# EAGLE design ScienceOnStick_V7-April2022 (EAGLE 9.5.2)
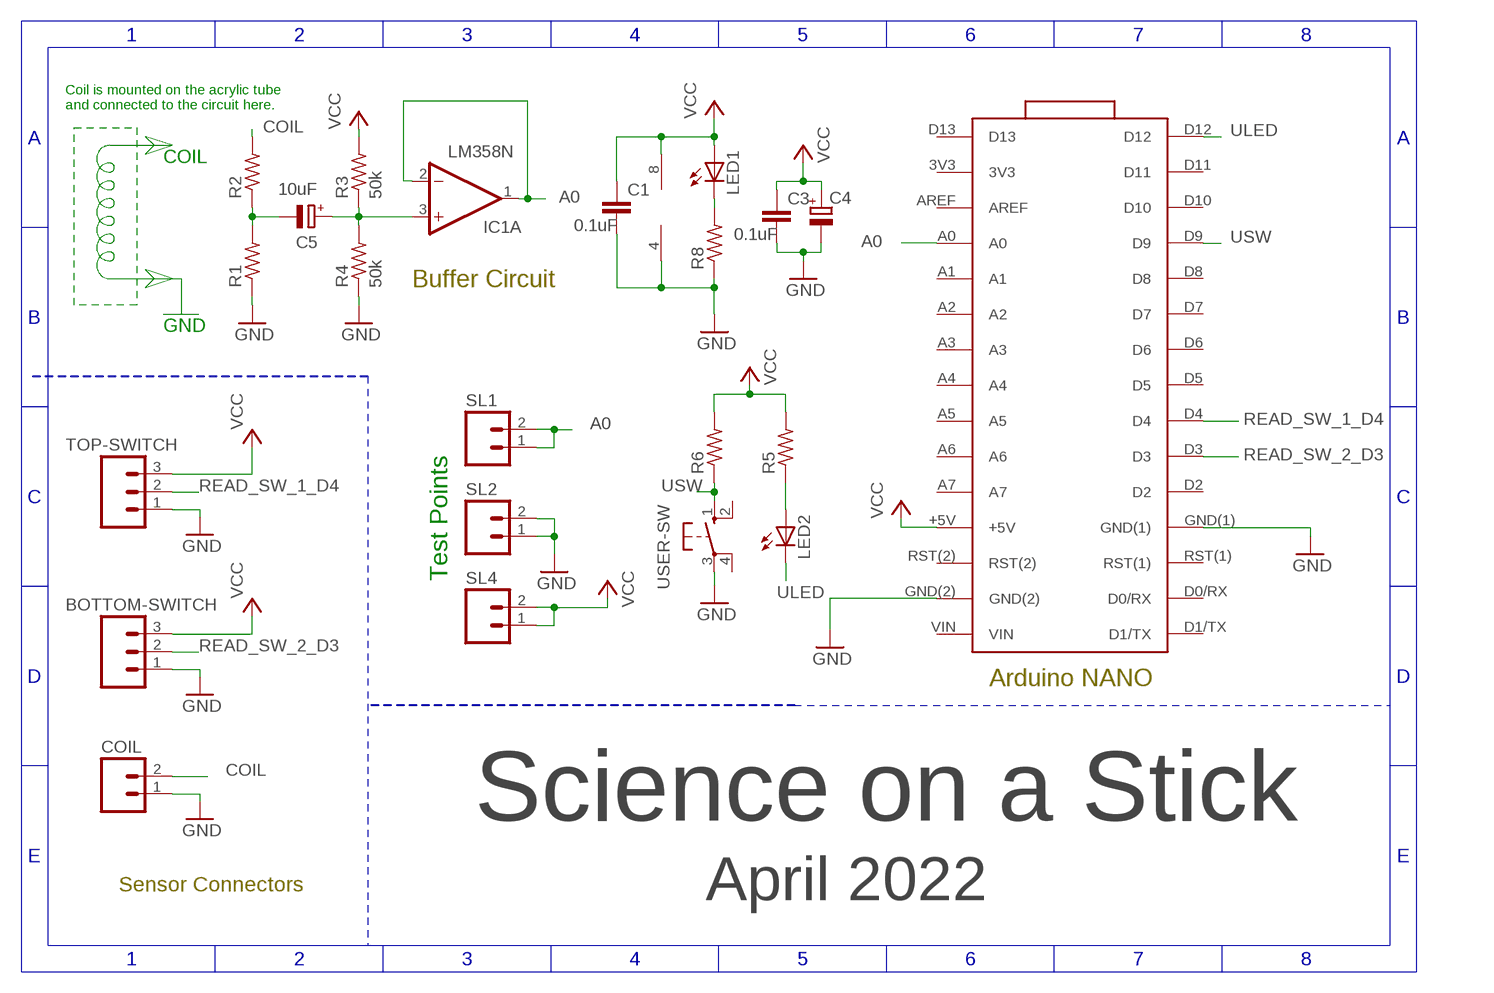
[diagram p0: schematic, sheet 1]

## Parts
BOTTOM-SWITCH  M03  [03P]
C1  0.1uF  C-EU025-025X050  [C025-025X050]
C3  0.1uF  C-EU025-025X050  [C025-025X050]
C4  CPOL-EUE2.5-6  [E2,5-6]
C5  10uF  CPOL-EUE2.5-6  [E2,5-6]
COIL  M02  [02P]
IC1  LM358N  [DIL08]
LED1  LED3MM  [LED3MM]
LED2  LED3MM  [LED3MM]
R1  RESISTOR0207/7  [0207/7]
R2  RESISTOR0207/7  [0207/7]
R3  50k  RESISTOR0207/7  [0207/7]
R4  50k  RESISTOR0207/7  [0207/7]
R5  RESISTOR0207/7  [0207/7]
R6  RESISTOR0207/7  [0207/7]
R8  RESISTOR0207/7  [0207/7]
SL1  M02  [02P]
SL2  M02  [02P]
SL4  M02  [02P]
TOP-SWITCH  M03  [03P]
U$1  ARDUINO_NANO_3_ARDUINO(NANO_3.0)  [ARDUINO_NANO_3_ARDUINO_NANO_30PIN]
USER-SW  40-XX  [B3F-40XX]

## Nets
A0: IC1.1(A:OUT) IC1.2(A:-IN) SL1.1 SL1.2 U$1.A0
CLAMP_SIGNAL: C5.+ IC1.3(A:+IN) R3.1 R4.2
COIL: COIL.2 R2.2
GND: BOTTOM-SWITCH.1 C1.2 C3.2 C4.- COIL.1 IC1.4(P:V-) R1.1 R4.1 R8.1 SL2.1 SL2.2 TOP-SWITCH.1 U$1.GND(1) U$1.GND(2) USER-SW.3(P)
N$1: C5.- R1.2 R2.1
N$2: LED2.A R5.1
N$5: LED1.K(C) R8.2
READ_SW_1_D4: TOP-SWITCH.2 U$1.D4
READ_SW_2_D3: BOTTOM-SWITCH.2 U$1.D3
ULED: LED2.K(C) U$1.D12
USW: R6.1 U$1.D9 USER-SW.1(S)
VCC: BOTTOM-SWITCH.3 C1.1 C3.1 C4.+ IC1.8(P:V+) LED1.A R3.2 R5.2 R6.2 SL4.1 SL4.2 TOP-SWITCH.3 U$1.+5V
Unconnected: IC1.5(B:+IN) IC1.6(B:-IN) IC1.7(B:OUT) U$1.3V3 U$1.A1 U$1.A2 U$1.A3 U$1.A4 U$1.A5 U$1.A6 U$1.A7 U$1.AREF U$1.D0/RX U$1.D1/TX U$1.D2 U$1.D5 U$1.D6 U$1.D7 U$1.D8 U$1.D10 U$1.D11 U$1.D13 U$1.RST(1) U$1.RST(2) U$1.VIN USER-SW.2(S1) USER-SW.4(P1)

## Buses
B$1

## Notes on the sheet
- Coil is mounted on the acrylic tube 
  and connected to the circuit here.
- COIL
- Buffer Circuit
- GND
- Test Points
- Arduino NANO
- Science on a Stick
- Sensor Connectors
- April 2022

## Library data of the parts
BOTTOM-SWITCH TOP-SWITCH = con-amp-quick:M03: AMP QUICK CONNECTOR; OC_FARNELL: unknown; OC_NEWARK: unknown
C1 C3 = Arduino_Hackathon_v5:C-EU: CAPACITOR, European symbol
C4 C5 = rcl:CPOL-EU: POLARIZED CAPACITOR, European symbol; SPICEPREFIX: C
COIL SL1 SL2 SL4 = con-amp-quick:M02: AMP QUICK CONNECTOR; OC_FARNELL: unknown; OC_NEWARK: unknown
IC1 = CEDT_JANUARY_2015_v5:LM358: OP AMP also LM158; LM258; LM2904 Source: http://cache.national.com/ds/LM/LM158.pdf
LED1 LED2 = CEDT_JANUARY_2015_v5:LED
R1-R4 = Arduino_Hackathon_v5:RESISTOR
R5 R6 R8 = CEDT_JANUARY_2015_v5:RESISTOR
U$1 = 1 D hour glass_V1:ARDUINO_NANO_3_ARDUINO(NANO_3.0)
USER-SW = switch-omron:40-XX: OMRON SWITCH; MF: OMRON COMPONENTS USA; MPN: B3F-4000; OC_FARNELL: 176434; OC_NEWARK: 36K3105

## Board
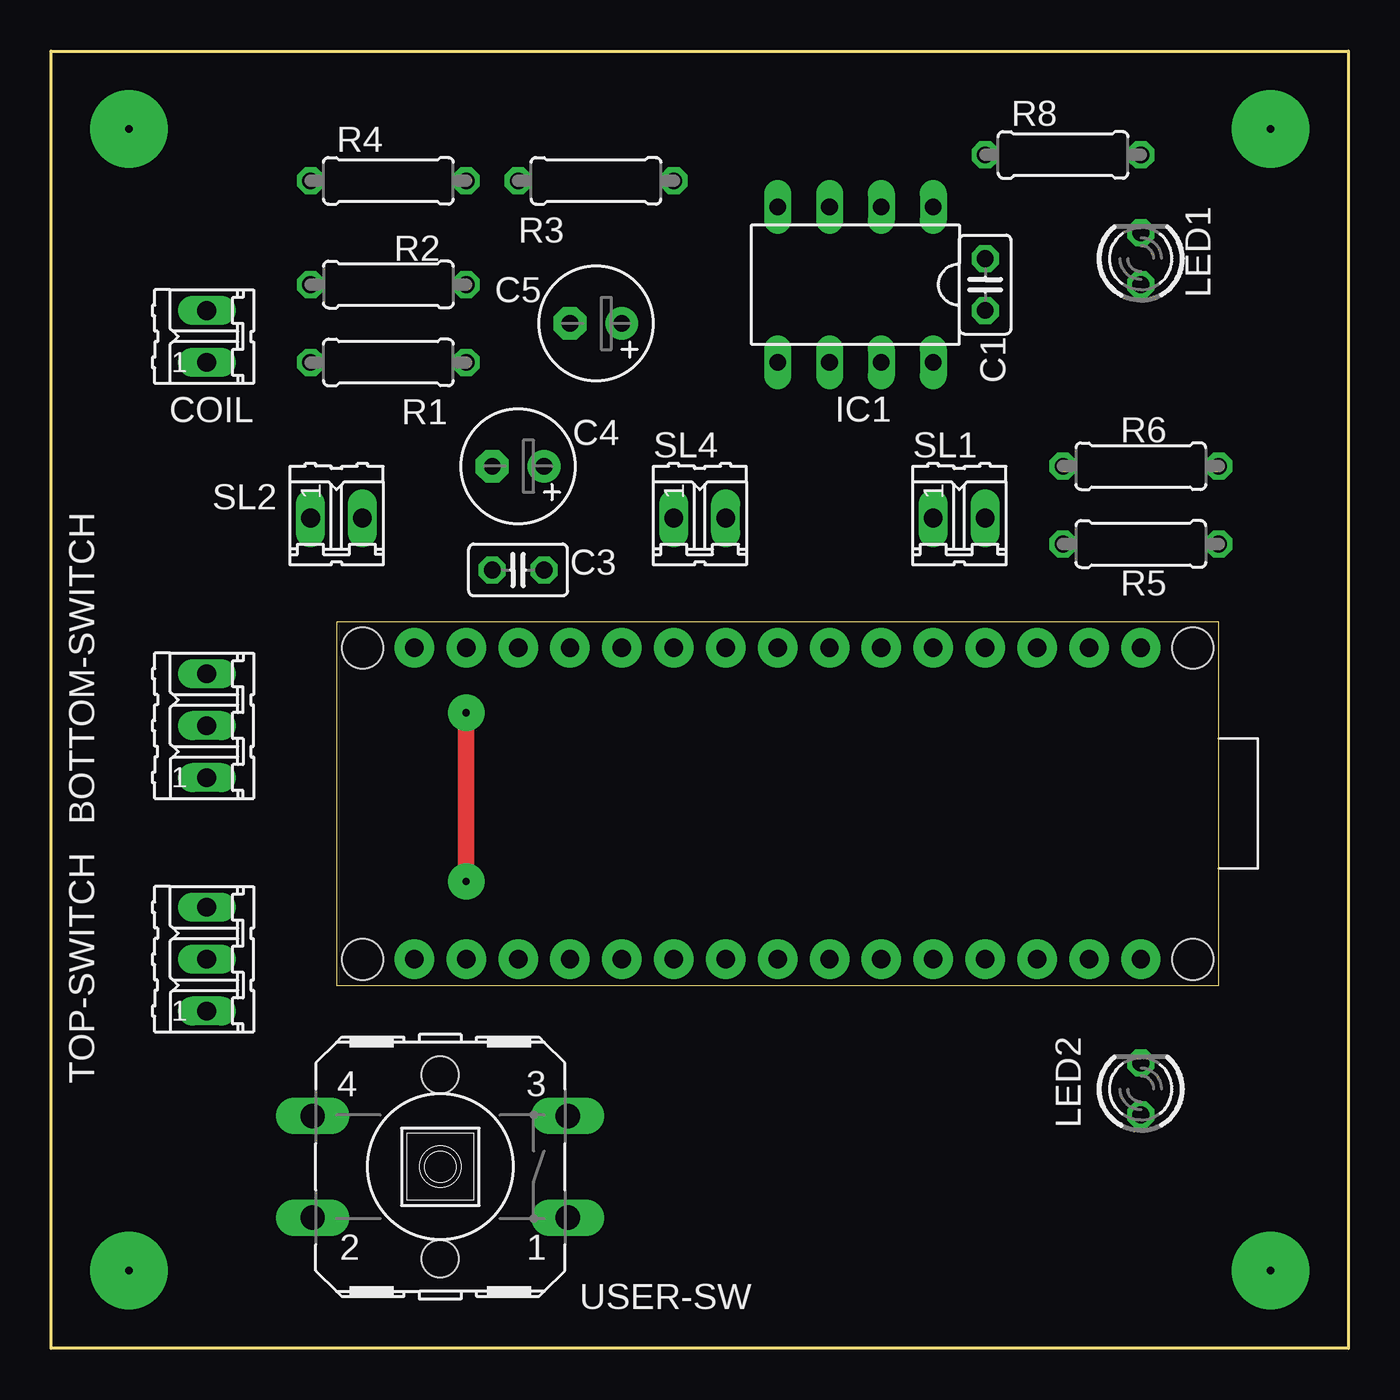
[diagram p1: board, top side]
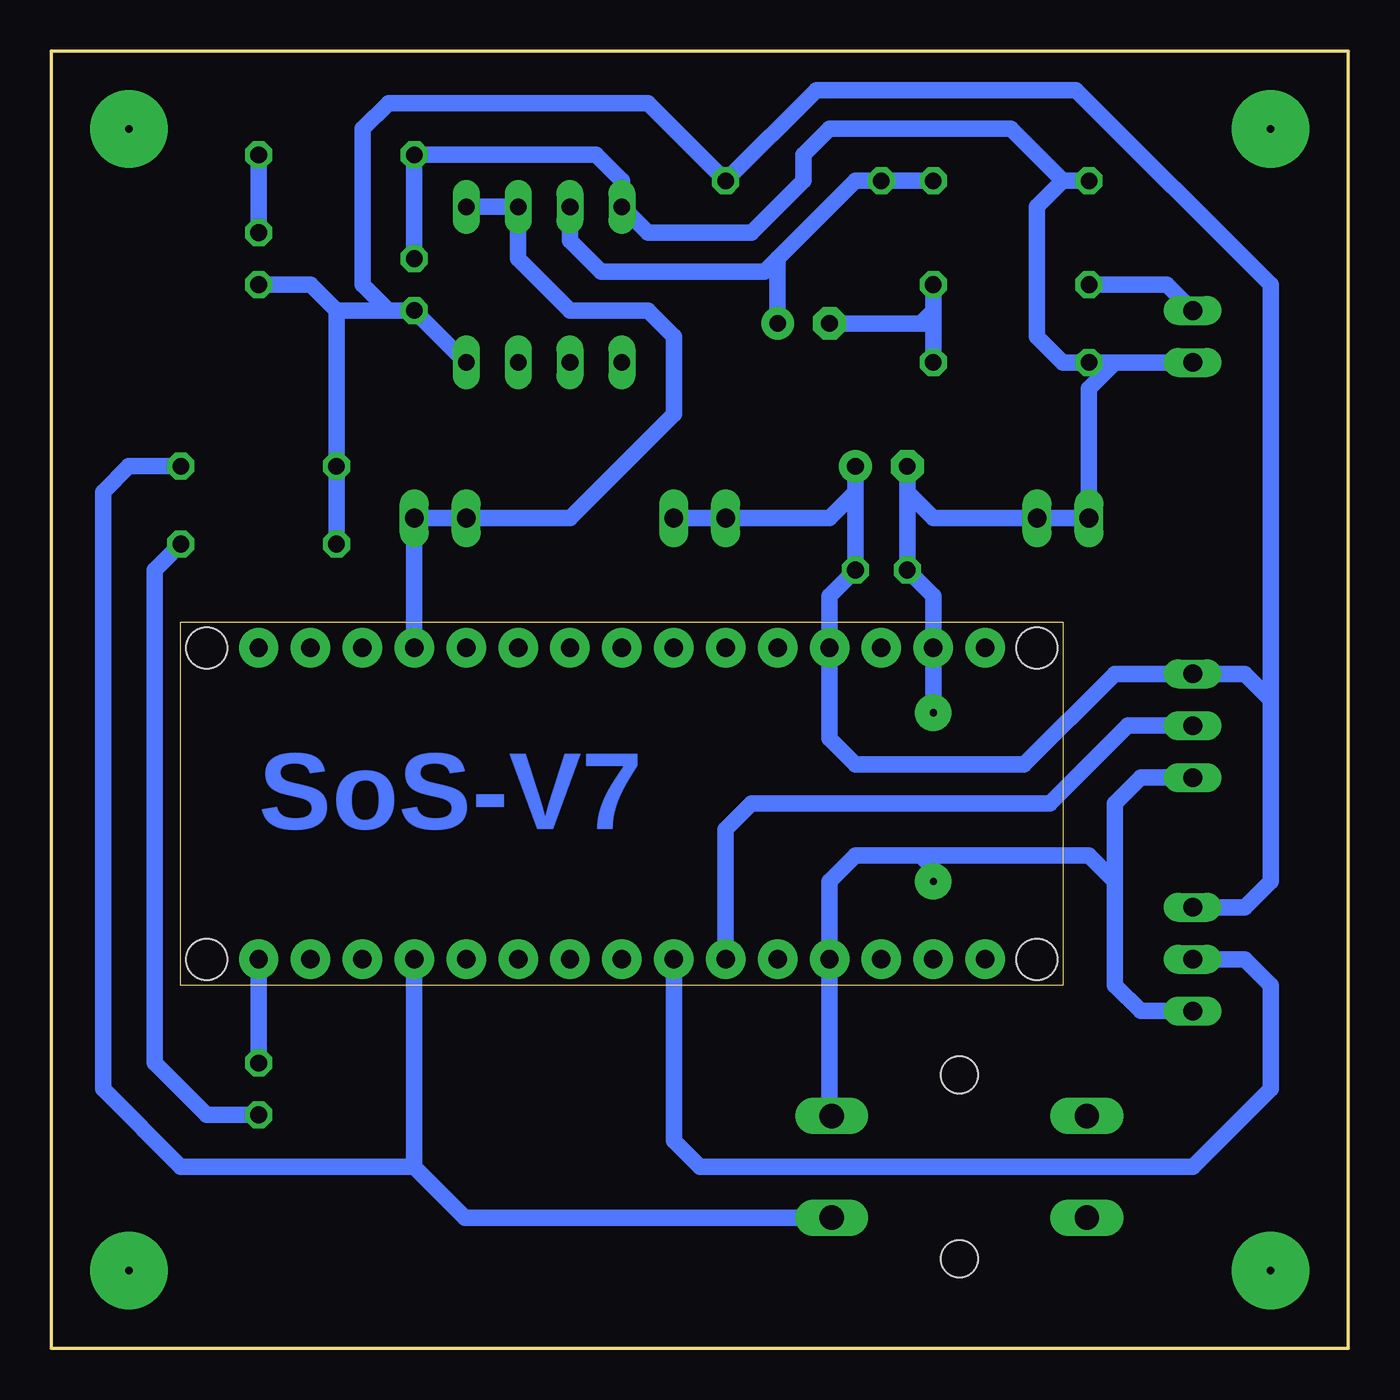
[diagram p2: board, bottom side, seen from below]

Size 63.5 x 63.5 mm. Coordinates in mm from the lower left corner, seen from the top.
Outline: 0,63.5 63.5,63.5 63.5,0 0,0 0,63.5
Copper layers (1*16): Top 0.035mm / dielectric 1.5mm / Bottom 0.035mm
Design rules "default *": minimum track width 6mil, minimum drill 0.35mm, track to track 6mil, track to pad 6mil, pad to pad 6mil, via to via 6mil, smd to smd 6mil, copper to edge 40mil, drill to drill 6mil, minimum pad ring 10mil, minimum via ring 8mil, stop-mask expansion 4mil, vias tented up to drill 0mil, thermal gap 10mil

### Footprints (pad centres in the part's own frame; a part is rotated, then mirrored left to right if it is on the bottom)
03P = drill 0.914 long: 1 -2.54,0; 2 0,0; 3 2.54,0
C025-025X050 = drill 0.813 octagon: 1 -1.27,0; 2 1.27,0
E2,5-6 = drill 0.813 pad 1.6: + -1.27,0 | drill 0.813 pad 1.6 octagon: - 1.27,0
02P = drill 0.914 long: 1 -1.27,0; 2 1.27,0
DIL08 = drill 0.813 long: 1 -3.81,-3.81; 2 -1.27,-3.81; 3 1.27,-3.81; 4 3.81,-3.81; 5 3.81,3.81; 6 1.27,3.81; 7 -1.27,3.81; 8 -3.81,3.81
LED3MM = drill 0.813 octagon: A -1.27,0; K 1.27,0
0207/7 = drill 0.813 octagon: 1 -3.81,0; 2 3.81,0
ARDUINO_NANO_3_ARDUINO_NANO_30PIN = drill 0.9 pad 1.93: 3V3 16.51,6.35; +5V 16.51,31.75; A0 16.51,11.43; A1 16.51,13.97; A2 16.51,16.51; A3 16.51,19.05; A4 16.51,21.59; A5 16.51,24.13; A6 16.51,26.67; A7 16.51,29.21; AREF 16.51,8.89; D0/RX 1.27,36.83; D1/TX 1.27,39.37; D2 1.27,29.21; D3 1.27,26.67; D4 1.27,24.13; D5 1.27,21.59; D6 1.27,19.05; D7 1.27,16.51; D8 1.27,13.97; D9 1.27,11.43; D10 1.27,8.89; D11 1.27,6.35; D12 1.27,3.81; D13 16.51,3.81; GND(1) 1.27,31.75; GND(2) 16.51,36.83; RST(1) 1.27,34.29; RST(2) 16.51,34.29; VIN 16.51,39.37 | hole 2: 1.27,41.91; 16.51,41.91; 16.51,1.27; 1.27,1.27
B3F-40XX = drill 1.194 long: 1 -6.248,2.489; 2 6.248,2.489; 3 -6.248,-2.489; 4 6.248,-2.489 | hole 1.803: 0,-4.496; 0,4.496

### Placement (x,y rotation side)
BOTTOM-SWITCH  7.62,30.48 90 top
C1  45.72,52.07 90 top
C3  22.86,38.1 180 top
C4  22.86,43.18 180 top
C5  26.67,50.16 180 top
COIL  7.62,49.53 90 top
IC1  39.37,52.07 180 top
LED1  53.34,53.34 90 top
LED2  53.34,12.7 90 top
R1  16.51,48.26 0 top
R2  16.51,52.07 180 top
R3  26.67,57.15 0 top
R4  16.51,57.15 0 top
R5  53.34,39.37 180 top
R6  53.34,43.18 180 top
R8  49.53,58.42 0 top
SL1  44.45,40.64 0 top
SL2  13.97,40.64 0 top
SL4  31.75,40.64 0 top
TOP-SWITCH  7.62,19.05 90 top
U$1  57.15,17.78 90 top
USER-SW  19.05,8.89 180 top

### Tracks (layer width: path | path; a pad name or v marks a point on that pad's centre or on a via)
A0
  Bottom 0.813: IC1.1 IC1.2 40.64,53.34 38.1,50.8 34.29,50.8 33.02,49.53 33.02,45.72 38.1,40.64 SL1.1 SL1.2 U$1.A0
CLAMP_SIGNAL
  Bottom 0.813: 38.1,54.61 IC1.3 38.1,54.23 36.58,52.7 28.57,52.7 27.94,53.34 | R4.2 R3.1 24.13,57.15 27.94,53.34 | 27.94,53.34 C5.+
COIL
  Bottom 0.813: R2.2 8.89,52.07 COIL.2
GND  (via drill 0.35 pad 1.78)
  Top 0.813: v20.32,31.11 v20.32,22.86
  Bottom 0.813: 11.43,48.26 R1.1 13.97,48.26 15.24,49.53 15.24,55.88 13.97,57.15 | 11.43,48.26 COIL.1 | C1.2 R8.1 36.83,58.42 35.56,57.15 IC1.4 34.29,54.61 29.21,54.61 26.67,57.15 26.67,58.42 25.4,59.69 16.51,59.69 13.97,57.15 | R4.1 13.97,57.15 | TOP-SWITCH.1 10.16,16.51 11.43,17.78 11.43,22.86 | USER-SW.3 25.4,11.48 U$1.GND(1) 25.4,22.86 24.13,24.13 20.95,24.13 | C4.- 21.59,41.91 | 21.59,41.91 C3.2 20.32,36.83 U$1.GND(2) v20.32,31.11 | 21.59,41.91 20.32,40.64 SL2.2 SL2.1 12.7,46.99 11.43,48.26 | BOTTOM-SWITCH.1 10.16,27.94 11.43,26.67 11.43,22.86 | v20.32,22.86 20.32,23.5 20.95,24.13 | 20.95,24.13 12.7,24.13 11.43,22.86
N$1
  Bottom 0.813: 20.32,50.8 R1.2 20.32,50.16 20.95,50.16 | 20.32,50.8 R2.1 | C5.- 21.59,50.16 20.95,50.16 | 20.32,50.8 20.95,50.16
N$2
  Bottom 0.813: LED2.A 55.88,11.43 58.42,13.97 58.42,38.1 R5.1
N$3  (via drill 0.35 pad 3.81)
  other vias: 3.81,3.81
N$4  (via drill 0.35 pad 3.81)
  other vias: 59.69,3.81
N$5
  Bottom 0.813: R8.2 LED1.K
N$9  (via drill 0.35 pad 3.81)
  other vias: 3.81,59.69
N$10  (via drill 0.35 pad 3.81)
  other vias: 59.69,59.69
READ_SW_1_D4
  Bottom 0.813: TOP-SWITCH.2 5.08,19.05 3.81,17.78 3.81,12.7 7.62,8.89 31.75,8.89 33.02,10.16 U$1.D4
READ_SW_2_D3
  Bottom 0.813: U$1.D3 30.48,25.4 29.21,26.67 14.61,26.67 10.79,30.48 BOTTOM-SWITCH.2
ULED
  Bottom 0.813: LED2.K U$1.D12
USW
  Bottom 0.813: USER-SW.1 43.23,6.4 45.72,8.89 | 45.72,8.89 U$1.D9 | R6.1 59.69,43.18 60.96,41.91 60.96,12.7 57.15,8.89 45.72,8.89
VCC
  Bottom 0.813: IC1.8 C1.1 46.99,50.8 | LED1.A 50.8,52.07 49.53,50.8 | 46.99,50.8 49.53,50.8 | 46.99,50.8 48.26,52.07 48.26,59.69 46.99,60.96 34.29,60.96 R3.2 26.04,61.59 13.34,61.59 3.81,52.07 3.81,31.75 | TOP-SWITCH.3 5.08,21.59 3.81,22.86 3.81,31.75 | 3.81,31.75 5.08,33.02 BOTTOM-SWITCH.3 11.43,33.02 15.88,28.57 24.13,28.57 25.4,29.84 U$1.+5V 25.4,36.83 C3.1 24.13,41.91 | R5.2 R6.2 49.53,50.8 | C4.+ 24.13,41.91 | 24.13,41.91 25.4,40.64 SL4.1 SL4.2

### Text on the board
Bottom: SoS-V7